# Altium schematic sheet MCISO-S01-V00-Master.SchDoc
size A3; SheetNumber: 1; SheetTotal: 9
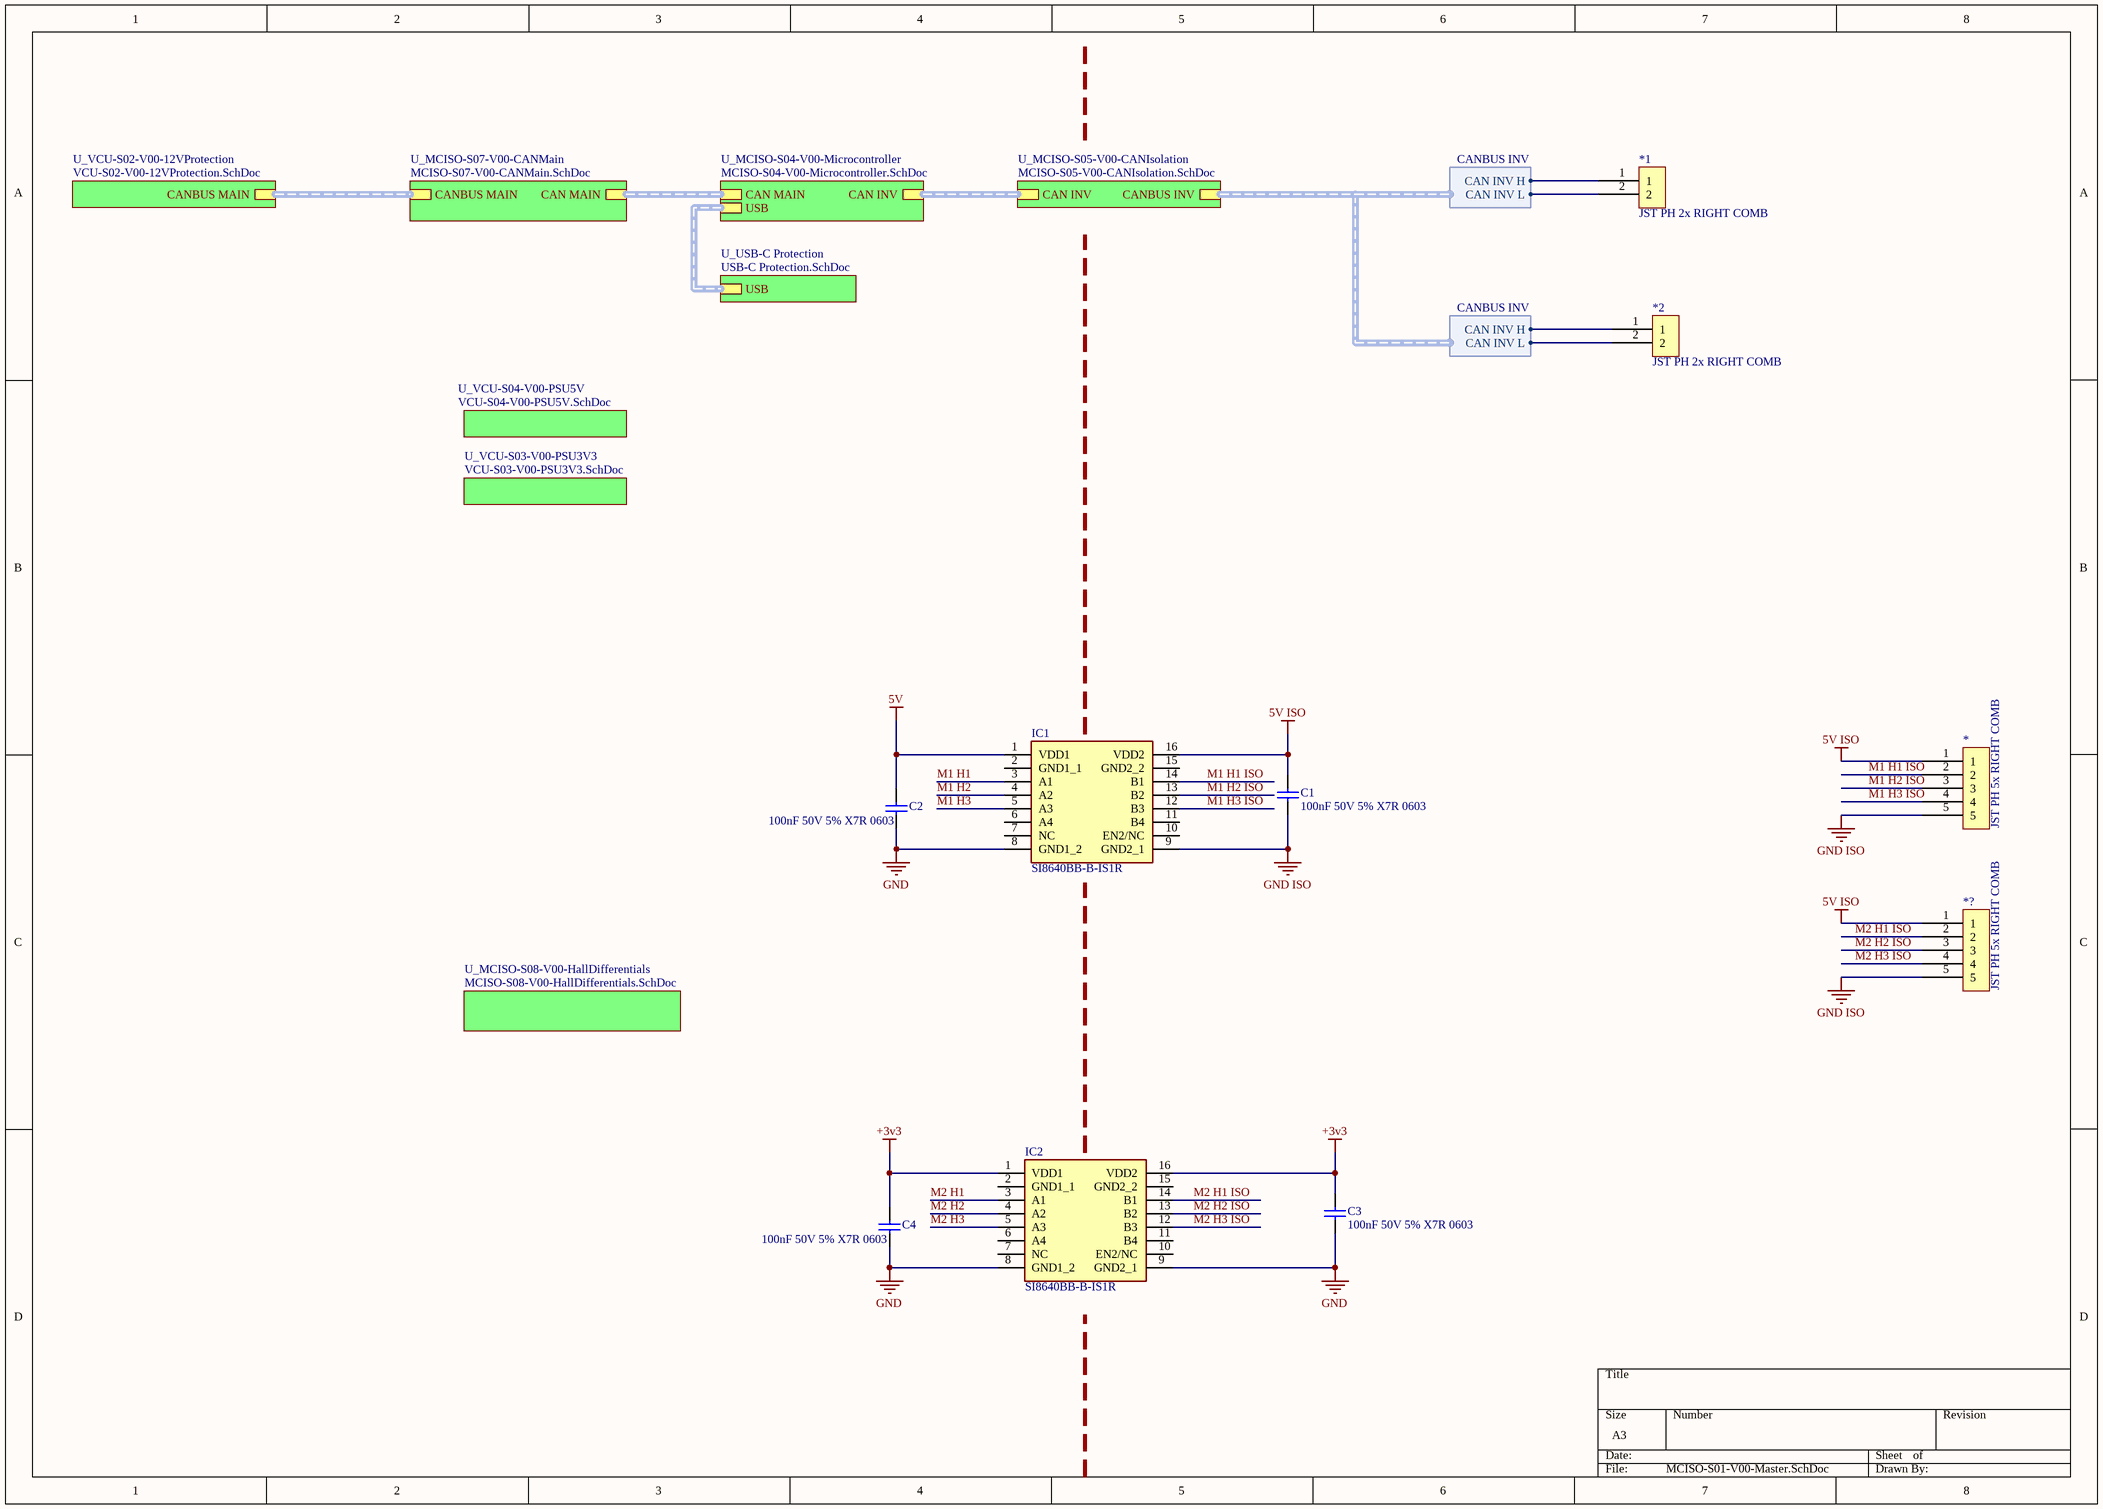
[diagram p0: MCISO-S01-V00-Master.SchDoc]

## Parts
*  JST PH 5x RIGHT COMB  [JST PH 5x RIGHT COMB]
*1  JST PH 2x RIGHT COMB  [JST PH 2x RIGHT COMB]
*2  JST PH 2x RIGHT COMB  [JST PH 2x RIGHT COMB]
*?  JST PH 5x RIGHT COMB  [JST PH 5x RIGHT COMB]
C1  100nF 50V 5% X7R 0603  [Cap_Ceramic_0603]
C2  100nF 50V 5% X7R 0603  [Cap_Ceramic_0603]
C3  100nF 50V 5% X7R 0603  [Cap_Ceramic_0603]
C4  100nF 50V 5% X7R 0603  [Cap_Ceramic_0603]
IC1  SI8640BB-B-IS1R  [SOIC127P600X175-16N]
IC2  SI8640BB-B-IS1R  [SOIC127P600X175-16N]

## Sub-sheets
U_MCISO-S04-V00-Microcontroller = MCISO-S04-V00-Microcontroller.SchDoc: CAN MAIN (harness CAN MAIN), CAN INV (harness CAN INV), USB (harness *)
U_MCISO-S05-V00-CANIsolation = MCISO-S05-V00-CANIsolation.SchDoc: CAN INV (harness CAN), CANBUS INV (harness CANBUS INV)
U_MCISO-S07-V00-CANMain = MCISO-S07-V00-CANMain.SchDoc: CAN MAIN (harness CAN2), CANBUS MAIN (harness CANBUS2)
U_MCISO-S08-V00-HallDifferentials = MCISO-S08-V00-HallDifferentials.SchDoc: no entries
U_USB-C Protection = USB-C Protection.SchDoc: USB (harness *)
U_VCU-S02-V00-12VProtection = VCU-S02-V00-12VProtection.SchDoc: CANBUS MAIN (harness CANBUS MAIN)
U_VCU-S03-V00-PSU3V3 = VCU-S03-V00-PSU3V3.SchDoc: no entries
U_VCU-S04-V00-PSU5V = VCU-S04-V00-PSU5V.SchDoc: no entries

## Harnesses
CANBUS INV: CAN INV H, CAN INV L

## Nets
5V: C2.2 IC1.1(VDD1)
5V ISO: *.1 *?.1 C1.2 IC1.16(VDD2)
+3v3: C3.2 C4.2 IC2.1(VDD1) IC2.16(VDD2)
GND: C2.1 C3.1 C4.1 IC1.8(GND1_2) IC2.8(GND1_2) IC2.9(GND2_1)
GND ISO: *.5 *?.5 C1.1 IC1.9(GND2_1)
M1 H1: IC1.3(A1)
M1 H1 ISO: *.2 IC1.14(B1)
M1 H2: IC1.4(A2)
M1 H2 ISO: *.3 IC1.13(B2)
M1 H3: IC1.5(A3)
M1 H3 ISO: *.4 IC1.12(B3)
M2 H1: IC2.3(A1)
M2 H1 ISO: *?.2 IC2.14(B1)
M2 H2: IC2.4(A2)
M2 H2 ISO: *?.3 IC2.13(B2)
M2 H3: IC2.5(A3)
M2 H3 ISO: *?.4 IC2.12(B3)
Net*1_1: *1.1 *2.1 ; sheet U_MCISO-S05-V00-CANIsolation/CANBUS INV.CAN INV H
Net*1_2: *1.2 *2.2 ; sheet U_MCISO-S05-V00-CANIsolation/CANBUS INV.CAN INV L

Not connected (* = marked no-connect by the designer): IC1 2(GND1_1) 6(A4) 7(NC) 10(EN2/NC) 11(B4) 15(GND2_2); IC2 2(GND1_1) 6(A4) 7(NC) 10(EN2/NC) 11(B4) 15(GND2_2)

## Buses and harness runs
harness sheet U_MCISO-S04-V00-Microcontroller/CAN INV = sheet U_MCISO-S05-V00-CANIsolation/CAN INV
harness sheet U_MCISO-S04-V00-Microcontroller/CAN MAIN = sheet U_MCISO-S07-V00-CANMain/CAN MAIN
harness sheet U_MCISO-S04-V00-Microcontroller/USB = sheet U_USB-C Protection/USB
harness sheet U_MCISO-S07-V00-CANMain/CANBUS MAIN = sheet U_VCU-S02-V00-12VProtection/CANBUS MAIN

## Library data of the parts
C1-C4 = 100nF 50V 5% X7R 0603: Capacitor, Ceramic, SMD, 100nF, 50V, 5%, X7R, 0603
IC1 IC2 = SI8640BB-B-IS1R: Integrated Circuit; Manufacturer_Name: Silicon Labs; Datasheet Link: https://www.arrow.com/en/products/si8640bb-b-is1r/silicon-labs; Height: 1.75mm; Manufacturer_Part_Number: SI8640BB-B-IS1R; Mouser Part Number: 634-SI8640BB-B-IS1R; Mouser Price/Stock: https://www.mouser.co.uk/ProductDetail/Silicon-Labs/SI8640BB-B-IS1R?qs=j6MGy4L9yX09sv%252BEYaun9w%3D%3D; Arrow Part Number: SI8640BB-B-IS1R; Arrow Price/Stock: https://www.arrow.com/en/products/si8640bb-b-is1r/silicon-labs